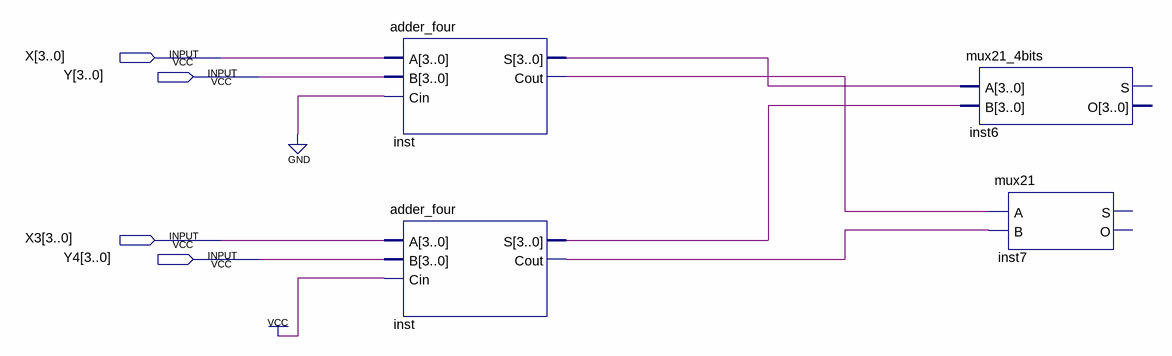
[diagram p0: schematic sheet]
// Quartus schematic Eight bits Carry Select Adder.bdf as structural Verilog: 4 symbols, 4 pins
module \Eight_bits_Carry_Select_Adder  (
  input  [3:0] X,
  input  [3:0] Y,
  input  [3:0] X3,
  input  [3:0] Y4
);

  wire inst_cout, inst_cout_2;
  wire [3:0] inst_s, inst_s_2;

  adder_four inst (.A(X), .B(Y), .Cin(1'b0), .S(inst_s_2), .Cout(inst_cout));
  adder_four inst_dup2 (.A(X3), .B(Y4), .Cin(1'b1), .S(inst_s), .Cout(inst_cout_2));
  mux21_4bits inst6 (.A(inst_s_2), .B(inst_s));  // open: O, S
  mux21 inst7 (.A(inst_cout), .B(inst_cout_2));  // open: O, S
endmodule
